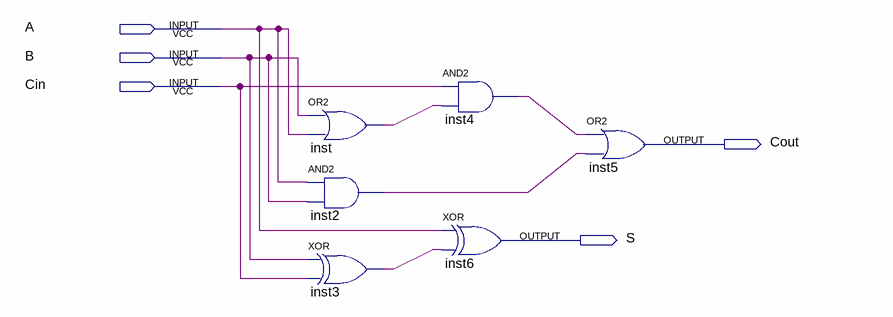
[diagram p0: schematic sheet]
// Quartus schematic adder_1b.bdf as structural Verilog: 6 symbols, 5 pins
module adder_1b (
  input  A,
  input  B,
  input  Cin,
  output Cout,
  output S
);

  wire inst2_out, inst3_out, inst4_out, inst_out;

  or inst (inst_out, B, A);
  and inst2 (inst2_out, A, B);
  xor inst3 (inst3_out, B, Cin);
  and inst4 (inst4_out, Cin, inst_out);
  xor inst6 (S, A, inst3_out);
  or inst5 (Cout, inst4_out, inst2_out);
endmodule
